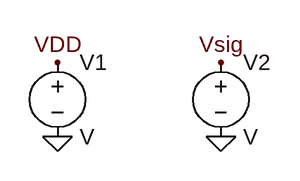
[diagram p0: schematic Draft3.asc]
Draft3.asc, the LTspice schematic file:
Version 4
SHEET 1 880 680
FLAG 176 112 0
FLAG 0 112 0
FLAG 0 32 VDD
FLAG 176 32 Vsig
SYMBOL voltage 0 16 R0
SYMATTR InstName V1
SYMBOL voltage 176 16 R0
SYMATTR InstName V2

The netlist it stands for:
* Draft3.asc
V1 VDD 0 V
V2 Vsig 0 V
.backanno
.end